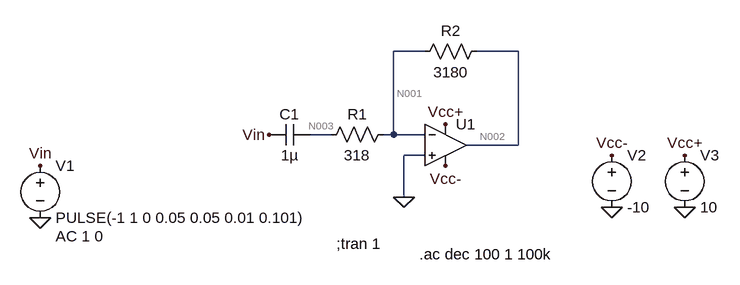
[diagram p0: schematic Draft2.asc]
Draft2.asc, the LTspice schematic file:
Version 4
SHEET 1 880 680
WIRE 144 0 96 0
WIRE 288 0 224 0
WIRE 0 128 -32 128
WIRE 96 128 96 0
WIRE 96 128 80 128
WIRE 144 128 96 128
WIRE 288 144 288 0
WIRE 288 144 208 144
WIRE 144 160 112 160
WIRE 112 224 112 160
FLAG 112 224 0
FLAG -448 176 Vin
FLAG -448 256 0
FLAG -96 128 Vin
FLAG 432 160 Vcc-
FLAG 544 160 Vcc+
FLAG 432 240 0
FLAG 544 240 0
FLAG 176 176 Vcc-
FLAG 176 112 Vcc+
SYMBOL OpAmps\\UniversalOpAmp2 176 144 R0
SYMATTR InstName U1
SYMBOL res 240 -16 R90
WINDOW 0 0 56 VBottom 2
WINDOW 3 32 56 VTop 2
SYMATTR InstName R2
SYMATTR Value 3180
SYMBOL voltage -448 160 R0
WINDOW 123 24 124 Left 2
WINDOW 39 0 0 Left 0
SYMATTR Value2 AC 1 0
SYMATTR InstName V1
SYMATTR Value PULSE(-1 1 0 0.05 0.05 0.01 0.101)
SYMBOL cap -32 112 R90
WINDOW 0 0 32 VBottom 2
WINDOW 3 32 32 VTop 2
SYMATTR InstName C1
SYMATTR Value 1µ
SYMBOL res 96 112 R90
WINDOW 0 0 56 VBottom 2
WINDOW 3 32 56 VTop 2
SYMATTR InstName R1
SYMATTR Value 318
SYMBOL voltage 432 144 R0
WINDOW 123 0 0 Left 0
WINDOW 39 0 0 Left 0
SYMATTR InstName V2
SYMATTR Value -10
SYMBOL voltage 544 144 R0
WINDOW 123 0 0 Left 0
WINDOW 39 0 0 Left 0
SYMATTR InstName V3
SYMATTR Value 10
TEXT 8 296 Left 2 !;tran 1
TEXT 136 312 Left 2 !.ac dec 100 1 100k

The netlist it stands for:
* Draft2.asc
XU1 0 N001 Vcc+ Vcc- N002 level2 Avol=1Meg GBW=10Meg Slew=10Meg Ilimit=25m Rail=0 Vos=0 En=0 Enk=0 In=0 Ink=0 Rin=500Meg  ; pins In+ In- V+ V- OUT
R2 N002 N001 3180
V1 Vin 0 PULSE(-1 1 0 0.05 0.05 0.01 0.101) AC 1 0
C1 N003 Vin 1µ
R1 N001 N003 318
V2 Vcc- 0 -10
V3 Vcc+ 0 10
;tran 1
.ac dec 100 1 100k
.lib UniversalOpAmp2.lib
.backanno
.end

* Results of the author's LTspice run, read from the files saved beside the schematic
* Operating Point, zero values left out:
*   V(vcc+) = 10 V
*   V(vcc-) = -10 V
*   V(vin) = -1 V
*   I(V2) = 999.5 µA
*   I(V3) = -999.5 µA
*   Ix(u1:3) = 999.5 µA
*   Ix(u1:4) = -999.5 µA
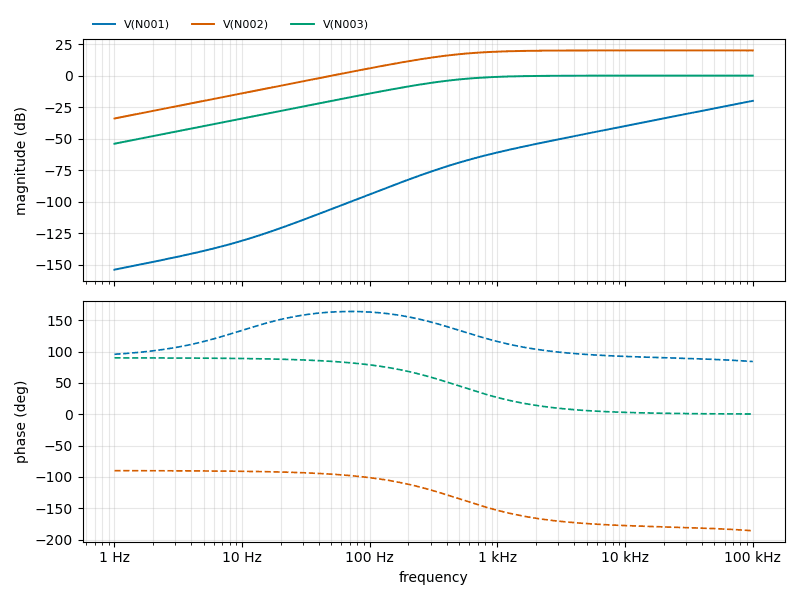
[diagram p1: AC Analysis of Draft2.asc, plotted from the saved traces]
* AC Analysis, 1 run:
*   V(N001): -153.89 dB at 1 Hz, -20.00 dB at 100 kHz, peak -20.00 dB at 100 kHz, 3 dB below the peak at 70.5 kHz
*   V(N002): -33.99 dB at 1 Hz, 19.95 dB at 100 kHz, peak 20.00 dB at 21.38 kHz, 3 dB below the peak at 500.2 Hz
*   V(N003): -53.99 dB at 1 Hz, 0.00 dB at 100 kHz, peak 0.00 dB at 100 kHz, 3 dB below the peak at 500.7 Hz